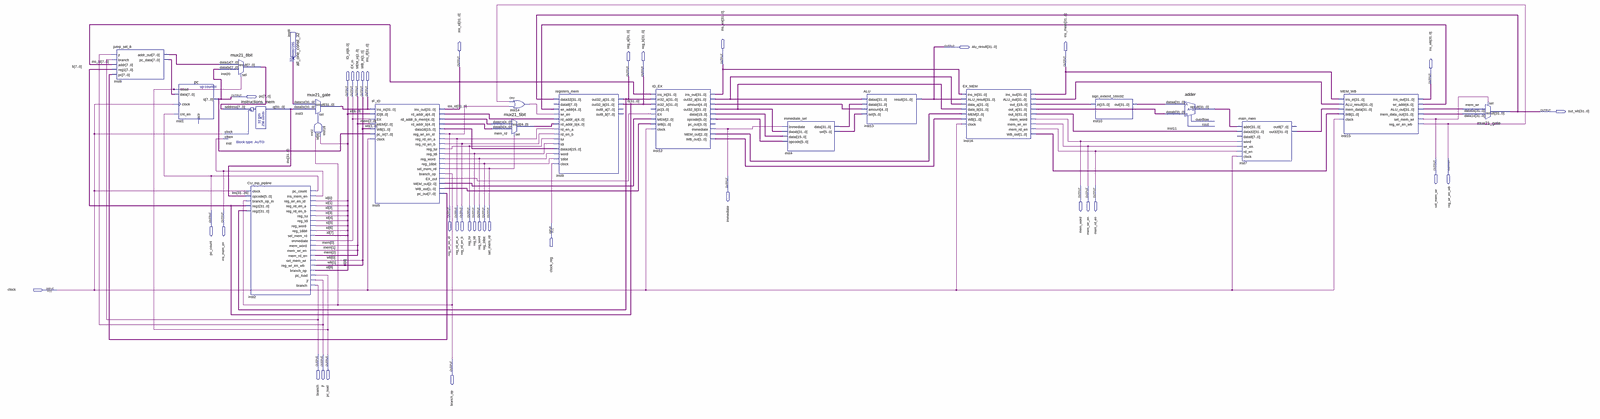
[diagram p0: schematic sheet, whole]
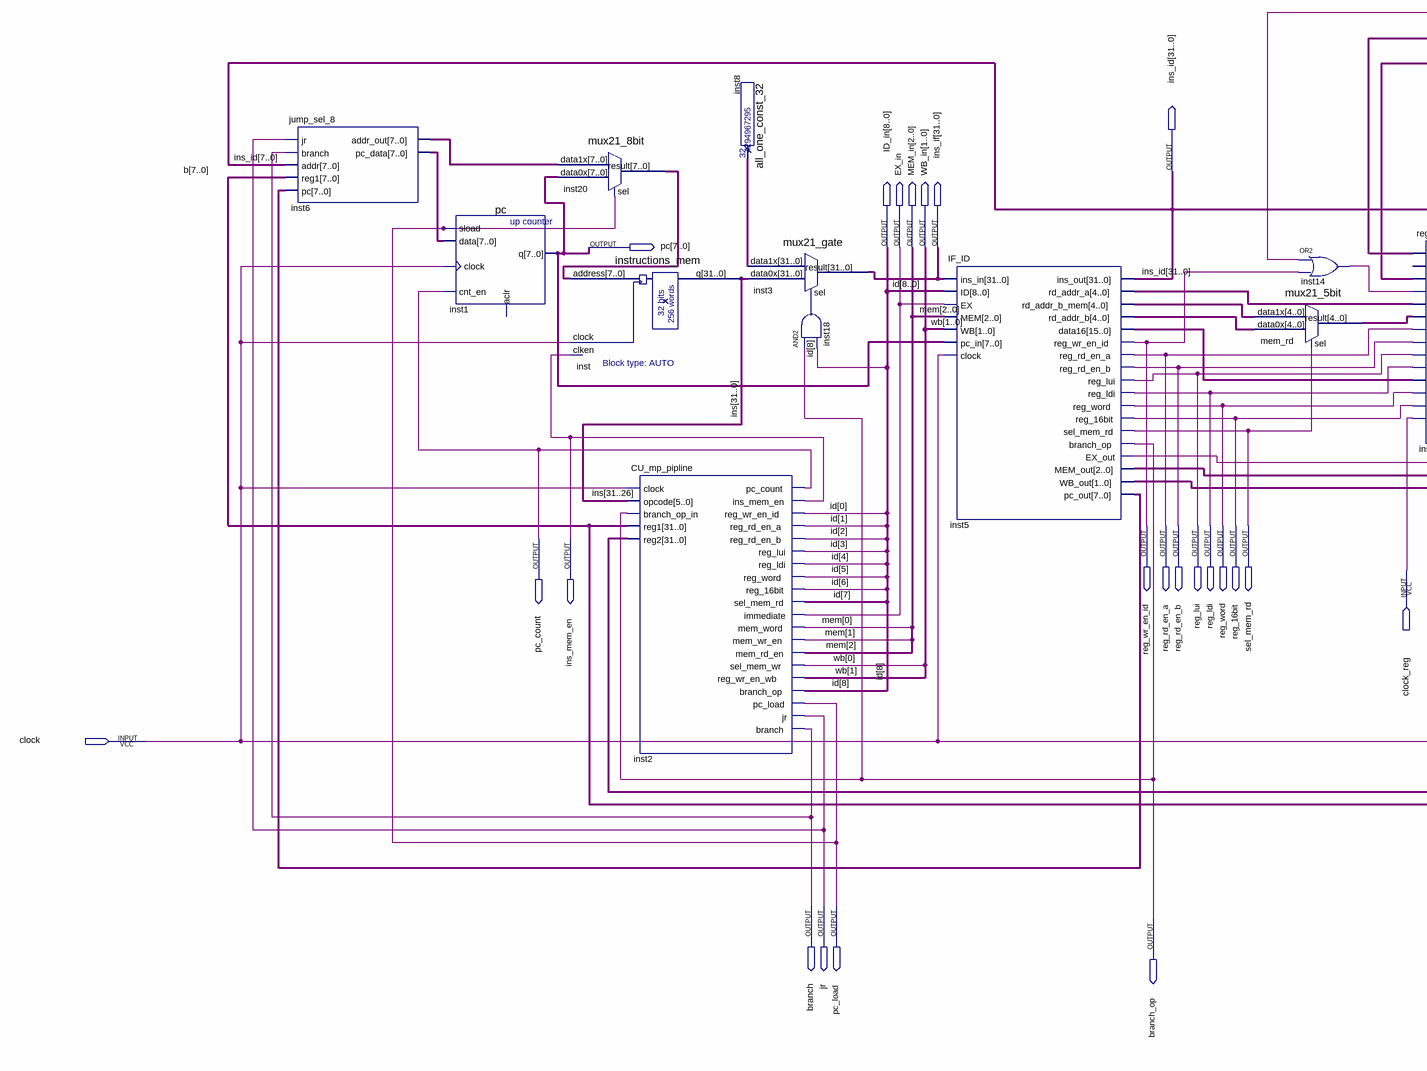
[diagram p1: schematic sheet, left part]
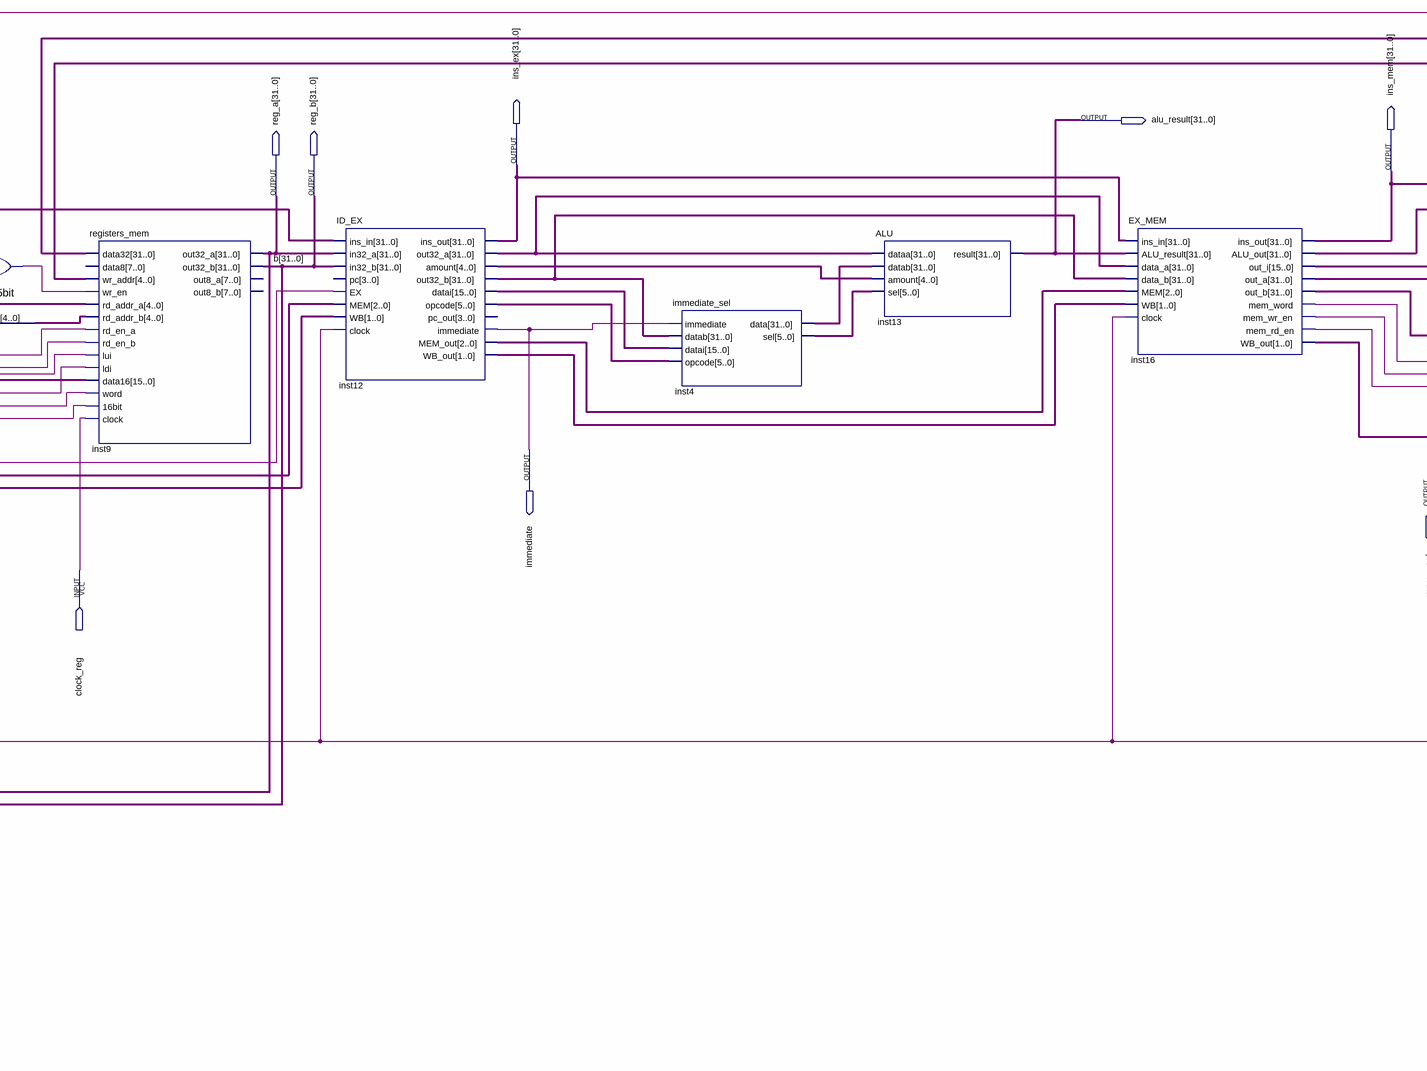
[diagram p2: schematic sheet, centre part]
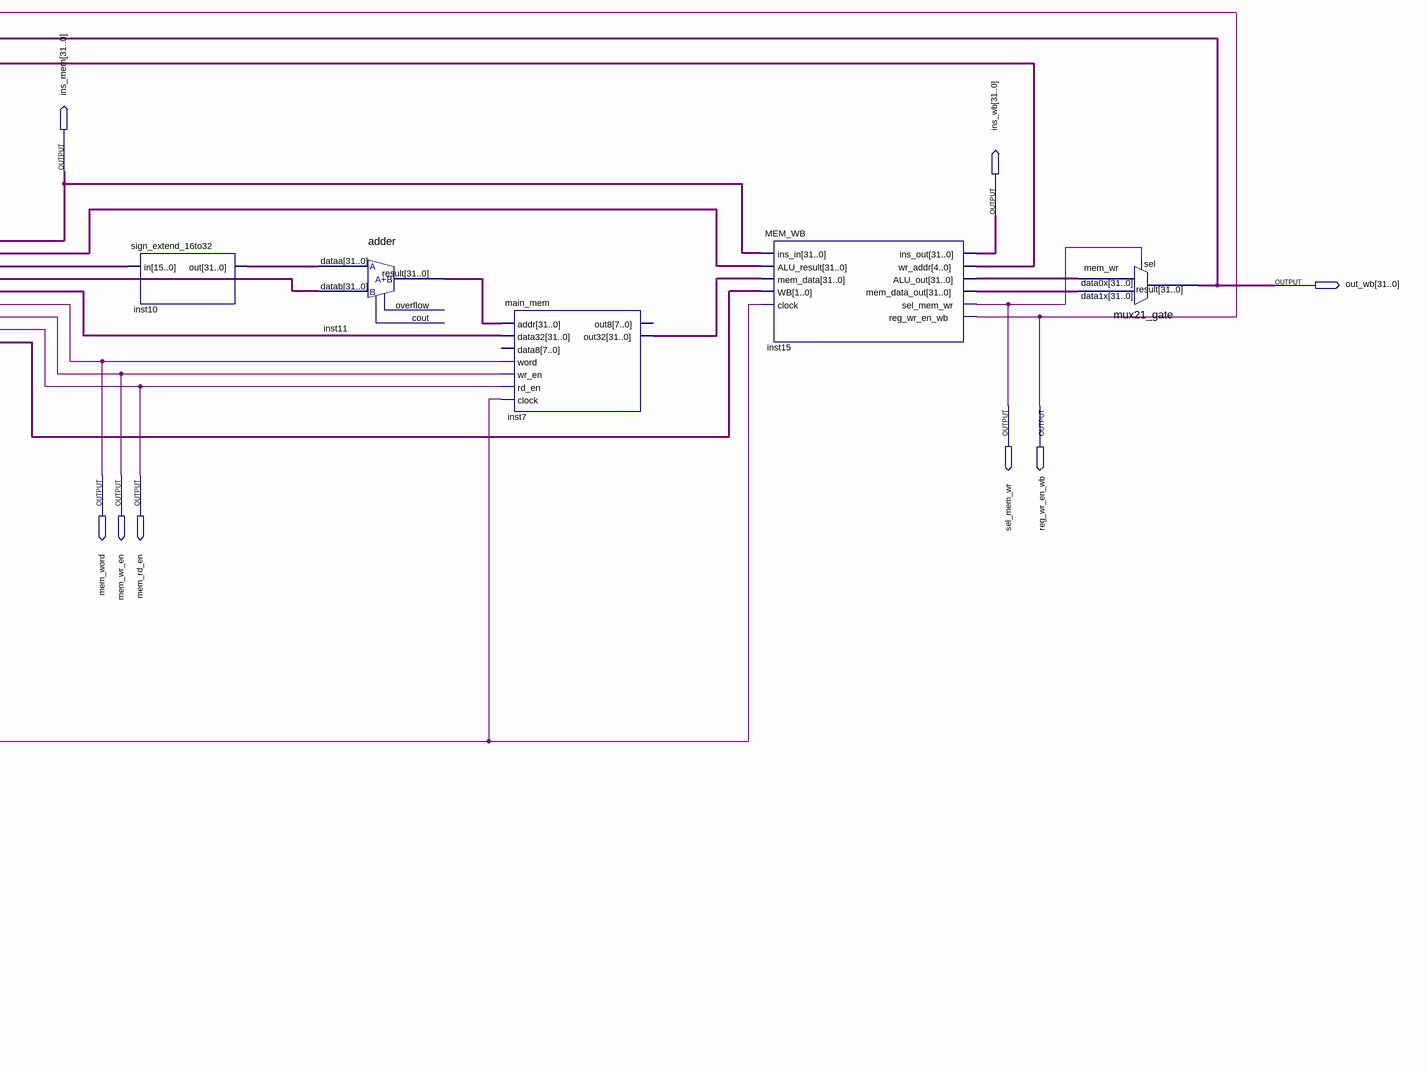
[diagram p3: schematic sheet, right part]
// Quartus schematic CPU_pipeline.bdf as structural Verilog: 21 symbols, 36 pins
module CPU_pipeline (
  input  clock_reg,
  input  clock,
  output [31:0] alu_result,
  output [31:0] ins_ex,
  output [31:0] ins_id,
  output [31:0] ins_mem,
  output [31:0] reg_a,
  output [31:0] reg_b,
  output [31:0] ins_wb,
  output [7:0] pc,
  output [8:0] ID_in,
  output EX_in,
  output [2:0] MEM_in,
  output [1:0] WB_in,
  output [31:0] ins_if,
  output [31:0] out_wb,
  output sel_mem_wr,
  output reg_wr_en_wb,
  output immediate,
  output mem_word,
  output mem_wr_en,
  output mem_rd_en,
  output reg_wr_en_id,
  output reg_rd_en_a,
  output reg_rd_en_b,
  output reg_lui,
  output reg_ldi,
  output reg_word,
  output reg_16bit,
  output sel_mem_rd,
  output pc_count,
  output ins_mem_en,
  output branch,
  output jr,
  output pc_load,
  output branch_op
);

  wire inst5_ex_out, inst14_out, inst18_out;
  wire [1:0] inst5_wb_out, inst12_wb_out, inst16_wb_out;
  wire [2:0] inst5_mem_out, inst12_mem_out;
  wire [4:0] inst5_rd_addr_a, inst5_rd_addr_b, inst5_rd_addr_b_mem, inst12_amount, inst15_wr_addr,
       mem_rd_result;
  wire [5:0] inst4_sel, inst12_opcode;
  wire [7:0] inst5_pc_out, inst6_addr_out, inst6_pc_data, inst20_result;
  wire [15:0] inst5_data16, inst12_datai, inst16_out_i;
  wire [31:0] ins, inst4_data, inst7_out32, inst8_result, inst10_out, inst11_result, inst12_out32_a,
       inst12_out32_b, inst15_alu_out, inst15_mem_data_out, inst16_alu_out, inst16_out_a, inst16_out_b;

  jump_sel_8 inst6 (
    .jr(jr), .branch(branch), .addr(ins_id[7:0]), .reg1(reg_b[7:0]), .pc(inst5_pc_out),
    .addr_out(inst6_addr_out), .pc_data(inst6_pc_data));
  pc inst1 (.sload(pc_load), .data(inst6_pc_data), .clock(clock), .cnt_en(pc_count), .q(pc));  // open: aclr
  mux21_8bit inst20 (.data1x(inst6_addr_out), .data0x(pc), .sel(pc_load), .result(inst20_result));
  instructions_mem inst (.address(inst20_result), .clock(clock), .clken(ins_mem_en), .q(ins));
  CU_mp_pipline inst2 (
    .clock(clock), .opcode(ins[31:26]), .branch_op_in(branch_op), .reg1(reg_b), .reg2(reg_a),
    .pc_count(pc_count), .ins_mem_en(ins_mem_en), .reg_wr_en_id(ID_in[0]), .reg_rd_en_a(ID_in[1]),
    .reg_rd_en_b(ID_in[2]), .reg_lui(ID_in[3]), .reg_ldi(ID_in[4]), .reg_word(ID_in[5]),
    .reg_16bit(ID_in[6]), .sel_mem_rd(ID_in[7]), .immediate(EX_in), .mem_word(MEM_in[0]),
    .mem_wr_en(MEM_in[1]), .mem_rd_en(MEM_in[2]), .sel_mem_wr(WB_in[0]), .reg_wr_en_wb(WB_in[1]),
    .branch_op(ID_in[8]), .pc_load(pc_load), .jr(jr), .branch(branch));
  all_one_const_32 inst8 (.result(inst8_result));
  mux21_gate inst3 (.data1x(inst8_result), .data0x(ins), .sel(inst18_out), .result(ins_if));
  and inst18 (inst18_out, branch_op, ID_in[8]);
  IF_ID inst5 (
    .ins_in(ins_if), .ID(ID_in), .EX(EX_in), .MEM(MEM_in), .WB(WB_in), .pc_in(pc), .clock(clock),
    .ins_out(ins_id), .rd_addr_a(inst5_rd_addr_a), .rd_addr_b_mem(inst5_rd_addr_b_mem),
    .rd_addr_b(inst5_rd_addr_b), .data16(inst5_data16), .reg_wr_en_id(reg_wr_en_id),
    .reg_rd_en_a(reg_rd_en_a), .reg_rd_en_b(reg_rd_en_b), .reg_lui(reg_lui), .reg_ldi(reg_ldi),
    .reg_word(reg_word), .reg_16bit(reg_16bit), .sel_mem_rd(sel_mem_rd), .branch_op(branch_op),
    .EX_out(inst5_ex_out), .MEM_out(inst5_mem_out), .WB_out(inst5_wb_out), .pc_out(inst5_pc_out));
  mux21_5bit mem_rd (.data1x(inst5_rd_addr_b_mem), .data0x(inst5_rd_addr_b), .sel(sel_mem_rd), .result(mem_rd_result));
  or inst14 (inst14_out, reg_wr_en_wb, reg_wr_en_id);
  registers_mem inst9 (
    .data32(out_wb), .wr_addr(inst15_wr_addr), .wr_en(inst14_out), .rd_addr_a(inst5_rd_addr_a),
    .rd_addr_b(mem_rd_result), .rd_en_a(reg_rd_en_a), .rd_en_b(reg_rd_en_b), .lui(reg_lui), .ldi(reg_ldi),
    .data16(inst5_data16), .word(reg_word), .\16bit (reg_16bit), .clock(clock_reg), .out32_a(reg_a),
    .out32_b(reg_b));  // open: data8, out8_a, out8_b
  ID_EX inst12 (
    .ins_in(ins_id), .in32_a(reg_a), .in32_b(reg_b), .EX(inst5_ex_out), .MEM(inst5_mem_out),
    .WB(inst5_wb_out), .clock(clock), .ins_out(ins_ex), .out32_a(inst12_out32_a), .amount(inst12_amount),
    .out32_b(inst12_out32_b), .datai(inst12_datai), .opcode(inst12_opcode), .immediate(immediate),
    .MEM_out(inst12_mem_out), .WB_out(inst12_wb_out));  // open: pc, pc_out
  immediate_sel inst4 (
    .immediate(immediate), .datab(inst12_out32_b), .datai(inst12_datai), .opcode(inst12_opcode),
    .data(inst4_data), .sel(inst4_sel));
  ALU inst13 (.dataa(inst12_out32_a), .datab(inst4_data), .amount(inst12_amount), .sel(inst4_sel), .result(alu_result));
  EX_MEM inst16 (
    .ins_in(ins_ex), .ALU_result(alu_result), .data_a(inst12_out32_a), .data_b(inst12_out32_b),
    .MEM(inst12_mem_out), .WB(inst12_wb_out), .clock(clock), .ins_out(ins_mem), .ALU_out(inst16_alu_out),
    .out_i(inst16_out_i), .out_a(inst16_out_a), .out_b(inst16_out_b), .mem_word(mem_word),
    .mem_wr_en(mem_wr_en), .mem_rd_en(mem_rd_en), .WB_out(inst16_wb_out));
  sign_extend_16to32 inst10 (.in(inst16_out_i), .out(inst10_out));
  adder inst11 (.dataa(inst10_out), .datab(inst16_out_a), .result(inst11_result));  // open: overflow, cout
  main_mem inst7 (
    .addr(inst11_result), .data32(inst16_out_b), .word(mem_word), .wr_en(mem_wr_en), .rd_en(mem_rd_en),
    .clock(clock), .out32(inst7_out32));  // open: data8, out8
  MEM_WB inst15 (
    .ins_in(ins_mem), .ALU_result(inst16_alu_out), .mem_data(inst7_out32), .WB(inst16_wb_out), .clock(clock),
    .ins_out(ins_wb), .wr_addr(inst15_wr_addr), .ALU_out(inst15_alu_out), .mem_data_out(inst15_mem_data_out),
    .sel_mem_wr(sel_mem_wr), .reg_wr_en_wb(reg_wr_en_wb));
  mux21_gate mem_wr (.data1x(inst15_mem_data_out), .data0x(inst15_alu_out), .sel(sel_mem_wr), .result(out_wb));

  // Other names for the same wires on the sheet: id[8:0] = ID_in; mem[2:0] = MEM_in; b[31:0] = reg_b; wb[1:0] = WB_in
endmodule
